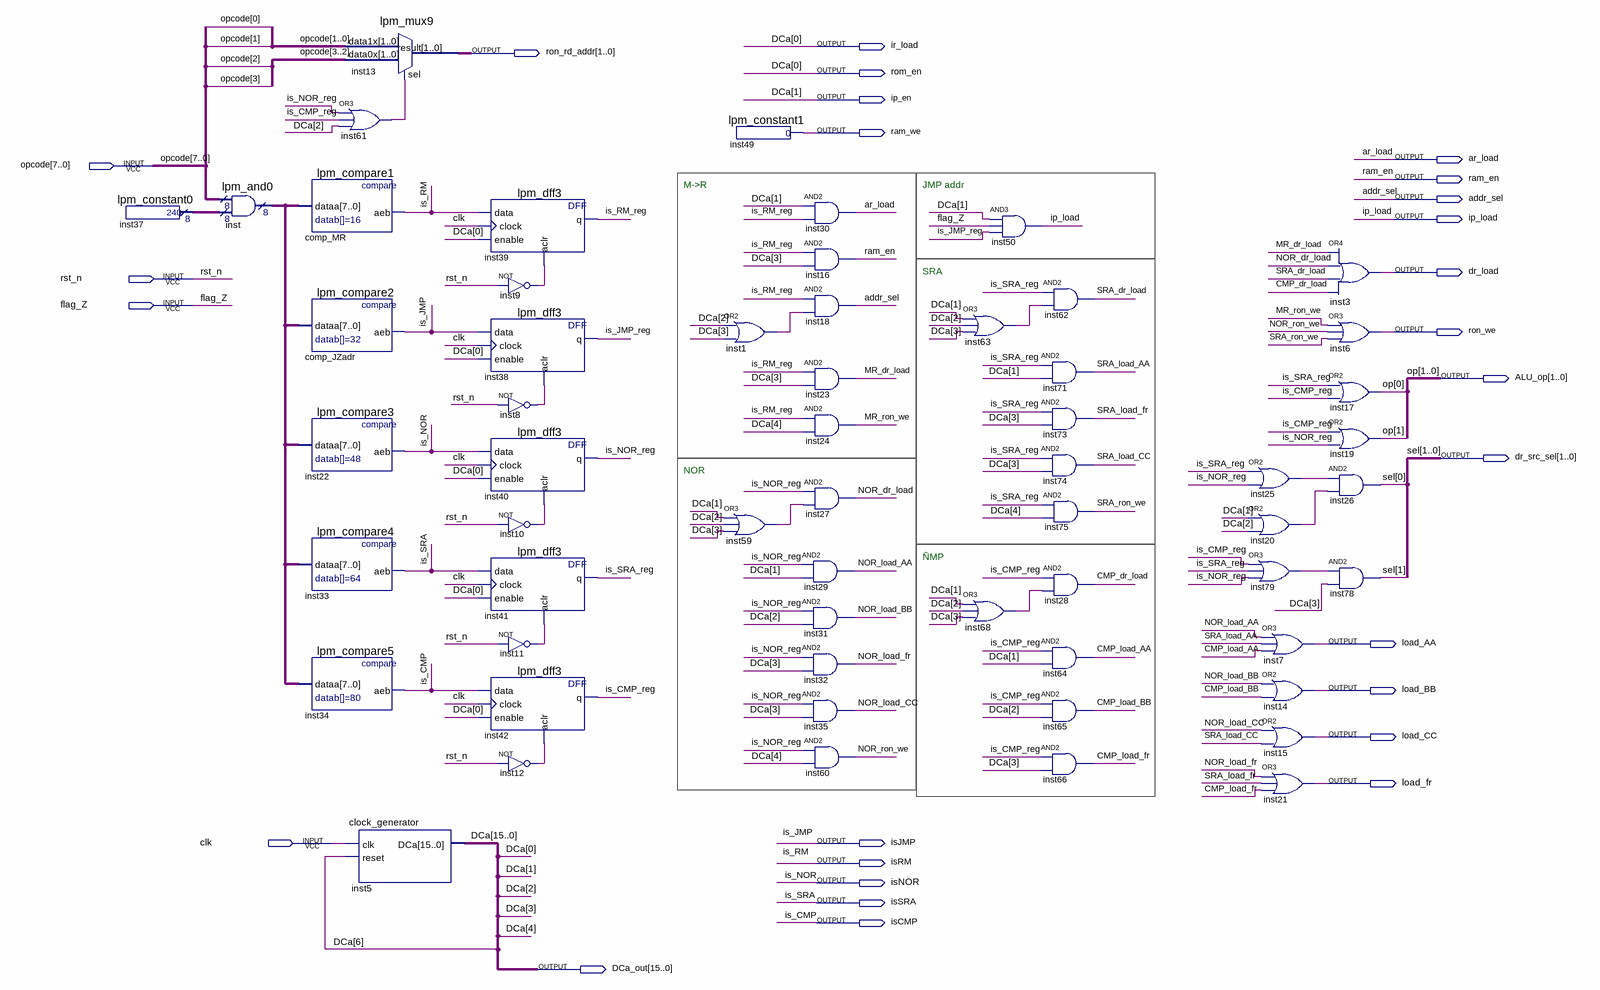
[diagram p0: schematic sheet]
// Quartus schematic control_unit.bdf as structural Verilog: 59 symbols, 27 pins
module control_unit (
  input  [7:0] opcode,
  input  rst_n,
  input  flag_Z,
  input  clk,
  output ir_load,
  output [1:0] ron_rd_addr,
  output rom_en,
  output ip_en,
  output ram_we,
  output ar_load,
  output ram_en,
  output addr_sel,
  output ip_load,
  output dr_load,
  output ron_we,
  output [1:0] ALU_op,
  output [1:0] dr_src_sel,
  output load_AA,
  output load_BB,
  output load_CC,
  output load_fr,
  output isJMP,
  output isRM,
  output isNOR,
  output isSRA,
  output isCMP,
  output [15:0] DCa_out
);

  wire CMP_dr_load, CMP_load_AA, CMP_load_BB, CMP_load_fr, inst1_out, inst8_out, inst9_out, inst10_out,
       inst11_out, inst12_out, inst20_out, inst25_out, inst59_out, inst61_out, inst63_out, inst68_out,
       inst79_out, is_CMP_reg, is_JMP_reg, is_NOR_reg, is_RM_reg, is_SRA_reg, MR_dr_load, MR_ron_we,
       NOR_dr_load, NOR_load_AA, NOR_load_BB, NOR_load_CC, NOR_load_fr, NOR_ron_we, SRA_dr_load, SRA_load_AA,
       SRA_load_CC, SRA_load_fr, SRA_ron_we;
  wire [7:0] inst37_result, inst_result;

  lpm_constant0 inst37 (.result(inst37_result));
  lpm_and0 inst (.data0x(opcode), .data1x(inst37_result), .result(inst_result));
  lpm_mux9 inst13 (.data1x(opcode[1:0]), .data0x(opcode[3:2]), .sel(inst61_out), .result(ron_rd_addr));
  or inst61 (inst61_out, is_NOR_reg, is_CMP_reg, DCa_out[2]);
  lpm_compare1 comp_MR (.dataa(inst_result), .aeb(isRM));
  lpm_compare2 comp_JZadr (.dataa(inst_result), .aeb(isJMP));
  lpm_compare3 inst22 (.dataa(inst_result), .aeb(isNOR));
  lpm_compare4 inst33 (.dataa(inst_result), .aeb(isSRA));
  lpm_compare5 inst34 (.dataa(inst_result), .aeb(isCMP));
  clock_generator inst5 (.clk(clk), .reset(DCa_out[6]), .DCa(DCa_out));
  lpm_dff3 inst39 (.data(isRM), .clock(clk), .enable(DCa_out[0]), .aclr(inst9_out), .q(is_RM_reg));
  not inst9 (inst9_out, rst_n);
  lpm_dff3 inst38 (.data(isJMP), .clock(clk), .enable(DCa_out[0]), .aclr(inst8_out), .q(is_JMP_reg));
  not inst8 (inst8_out, rst_n);
  lpm_dff3 inst40 (.data(isNOR), .clock(clk), .enable(DCa_out[0]), .aclr(inst10_out), .q(is_NOR_reg));
  not inst10 (inst10_out, rst_n);
  lpm_dff3 inst41 (.data(isSRA), .clock(clk), .enable(DCa_out[0]), .aclr(inst11_out), .q(is_SRA_reg));
  not inst11 (inst11_out, rst_n);
  lpm_dff3 inst42 (.data(isCMP), .clock(clk), .enable(DCa_out[0]), .aclr(inst12_out), .q(is_CMP_reg));
  not inst12 (inst12_out, rst_n);
  lpm_constant1 inst49 (.result(ram_we));
  or inst1 (inst1_out, DCa_out[2], DCa_out[3]);
  or inst59 (inst59_out, DCa_out[1], DCa_out[2], DCa_out[3]);
  and inst30 (ar_load, DCa_out[1], is_RM_reg);
  and inst16 (ram_en, is_RM_reg, DCa_out[3]);
  and inst18 (addr_sel, is_RM_reg, inst1_out);
  and inst23 (MR_dr_load, is_RM_reg, DCa_out[3]);
  and inst24 (MR_ron_we, is_RM_reg, DCa_out[4]);
  and inst27 (NOR_dr_load, is_NOR_reg, inst59_out);
  and inst29 (NOR_load_AA, is_NOR_reg, DCa_out[1]);
  and inst31 (NOR_load_BB, is_NOR_reg, DCa_out[2]);
  and inst32 (NOR_load_fr, is_NOR_reg, DCa_out[3]);
  and inst35 (NOR_load_CC, is_NOR_reg, DCa_out[3]);
  and inst60 (NOR_ron_we, is_NOR_reg, DCa_out[4]);
  or inst63 (inst63_out, DCa_out[1], DCa_out[2], DCa_out[3]);
  or inst68 (inst68_out, DCa_out[1], DCa_out[2], DCa_out[3]);
  and inst50 (ip_load, DCa_out[1], flag_Z, is_JMP_reg);
  and inst71 (SRA_load_AA, is_SRA_reg, DCa_out[1]);
  and inst73 (SRA_load_fr, is_SRA_reg, DCa_out[3]);
  and inst74 (SRA_load_CC, is_SRA_reg, DCa_out[3]);
  and inst64 (CMP_load_AA, is_CMP_reg, DCa_out[1]);
  and inst65 (CMP_load_BB, is_CMP_reg, DCa_out[2]);
  and inst66 (CMP_load_fr, is_CMP_reg, DCa_out[3]);
  and inst62 (SRA_dr_load, is_SRA_reg, inst63_out);
  and inst75 (SRA_ron_we, is_SRA_reg, DCa_out[4]);
  and inst28 (CMP_dr_load, is_CMP_reg, inst68_out);
  or inst25 (inst25_out, is_SRA_reg, is_NOR_reg);
  or inst20 (inst20_out, DCa_out[1], DCa_out[2]);
  or inst79 (inst79_out, is_CMP_reg, is_SRA_reg, is_NOR_reg);
  or inst7 (load_AA, NOR_load_AA, SRA_load_AA, CMP_load_AA);
  or inst14 (load_BB, NOR_load_BB, CMP_load_BB);
  or inst15 (load_CC, NOR_load_CC, SRA_load_CC);
  or inst21 (load_fr, NOR_load_fr, SRA_load_fr, CMP_load_fr);
  or inst3 (dr_load, MR_dr_load, NOR_dr_load, SRA_dr_load, CMP_dr_load);
  or inst6 (ron_we, MR_ron_we, NOR_ron_we, SRA_ron_we);
  or inst17 (ALU_op[0], is_SRA_reg, is_CMP_reg);
  or inst19 (ALU_op[1], is_CMP_reg, is_NOR_reg);
  and inst26 (dr_src_sel[0], inst25_out, inst20_out);
  and inst78 (dr_src_sel[1], inst79_out, DCa_out[3]);

  assign ip_en = DCa_out[1];
  assign ir_load = DCa_out[0];
  assign rom_en = DCa_out[0];

  // Other names for the same wires on the sheet: DCa[15:0] = DCa_out; is_CMP = isCMP; is_JMP = isJMP; is_NOR = isNOR;
  //   is_RM = isRM; is_SRA = isSRA; op[1:0] = ALU_op; sel[1:0] = dr_src_sel

  // Notes on the sheet:
  //   M->R
  //   JMP addr
  //   SRA
  //   NOR
  //   ÑMP
endmodule
